# EAGLE schematic single-spi-interface (EAGLE 6.6.0)
DESIGNER: JONNEW, MWL@MIT; DESIGN_NAME: spi-interface (2x64_hirose-circular); LICENSE: (c) Jon Newman CC-BY-SA-NC 4.0; REVISION: 1.2
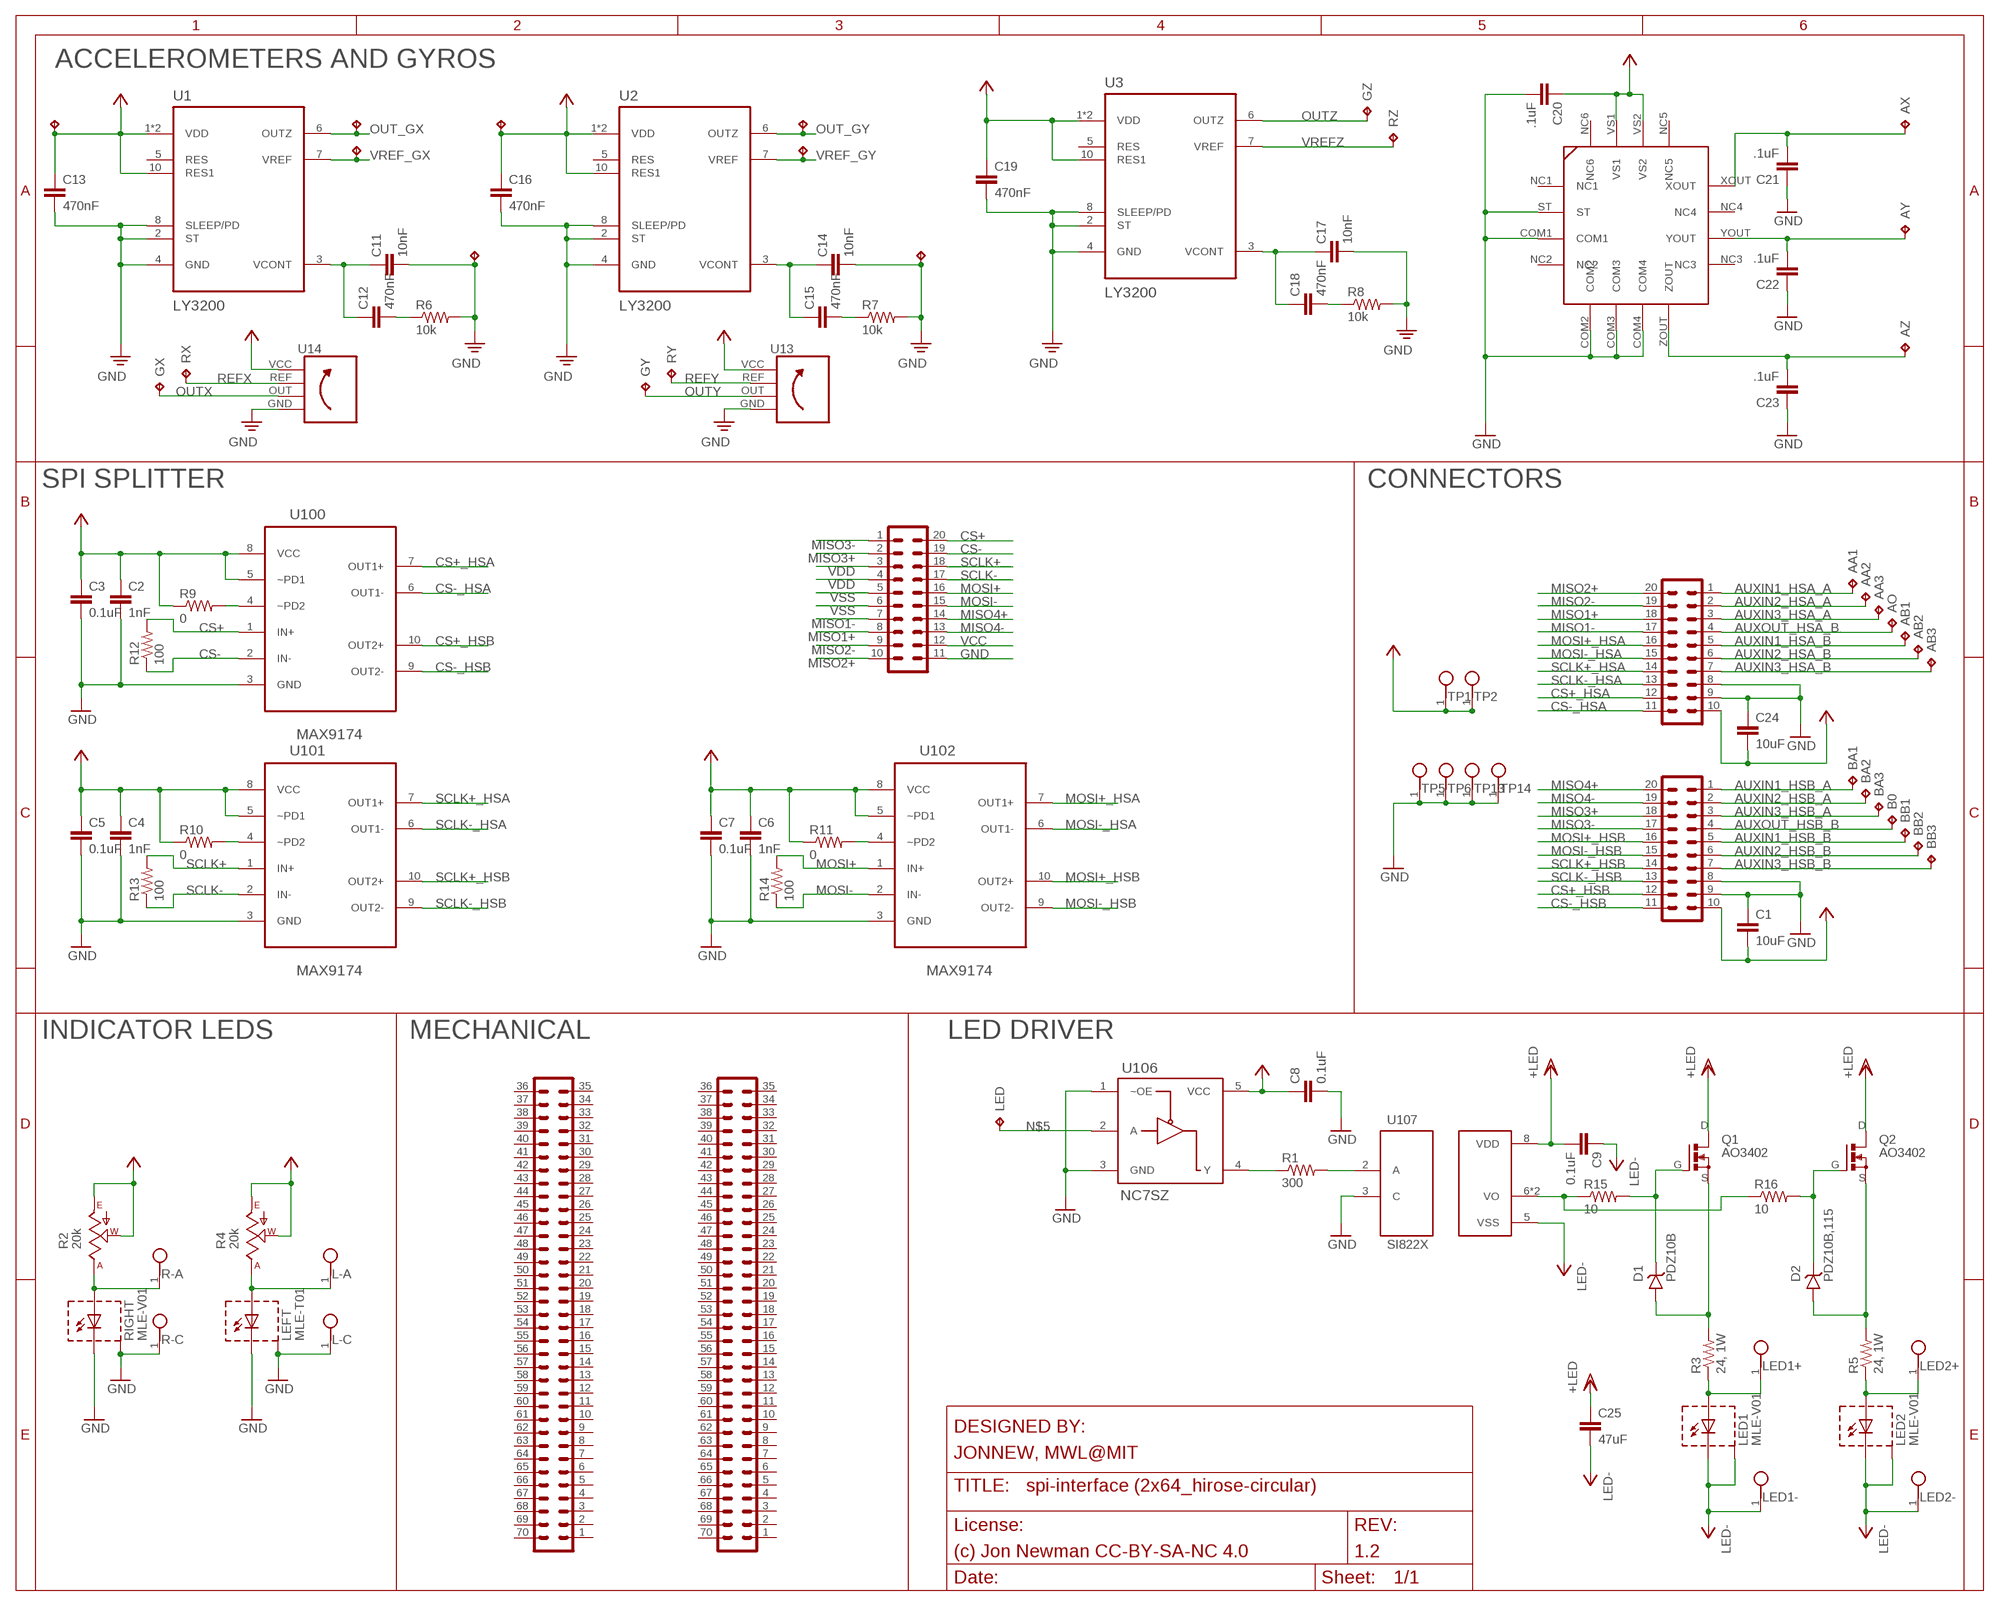
[diagram p0: schematic, sheet 1]

## Parts
AA1  TP_0.5MM  [TESTPOINT_0.5MM]
AA2  TP_0.5MM  [TESTPOINT_0.5MM]
AA3  TP_0.5MM  [TESTPOINT_0.5MM]
AB1  TP_0.5MM  [TESTPOINT_0.5MM]
AB2  TP_0.5MM  [TESTPOINT_0.5MM]
AB3  TP_0.5MM  [TESTPOINT_0.5MM]
AO  TP_0.5MM  [TESTPOINT_0.5MM]
AX  TP_0.5MM  [TESTPOINT_0.5MM]
AY  TP_0.5MM  [TESTPOINT_0.5MM]
AZ  TP_0.5MM  [TESTPOINT_0.5MM]
B0  TP_0.5MM  [TESTPOINT_0.5MM]
BA1  TP_0.5MM  [TESTPOINT_0.5MM]
BA2  TP_0.5MM  [TESTPOINT_0.5MM]
BA3  TP_0.5MM  [TESTPOINT_0.5MM]
BB1  TP_0.5MM  [TESTPOINT_0.5MM]
BB2  TP_0.5MM  [TESTPOINT_0.5MM]
BB3  TP_0.5MM  [TESTPOINT_0.5MM]
C1  10uF  C_0805  [0805]
C2  1nF  C_0201  [0201]
C3  0.1uF  C_0402  [0402]
C4  1nF  C_0201  [0201]
C5  0.1uF  C_0402  [0402]
C6  1nF  C_0201  [0201]
C7  0.1uF  C_0402  [0402]
C8  0.1uF  C_0402  [0402]
C9  0.1uF  C_0402  [0402]
C11  10nF  C_0201  [0201]
C12  470nF  C_0201  [0201]
C13  470nF  C_0201  [0201]
C14  10nF  C_0201  [0201]
C15  470nF  C_0201  [0201]
C16  470nF  C_0201  [0201]
C17  10nF  C_0201  [0201]
C18  470nF  C_0201  [0201]
C19  470nF  C_0201  [0201]
C20  .1uF  C_0402  [0402]
C21  .1uF  C_0201  [0201]
C22  .1uF  C_0201  [0201]
C23  .1uF  C_0201  [0201]
C24  10uF  C_0805  [0805]
C25  47uF  C_1206  [1206]
D1  PDZ10B  Z-DIODE_SOD-323  [SOD-323]
D2  PDZ10B,115  Z-DIODE_SOD-323  [SOD-323]
DIO_E1B  PINHD-2X10_DF40-20REC  [DF40-20REC]
DIO_E1B1  PINHD-2X10_DF40-20REC  [DF40-20REC]
GX  TP_0.5MM  [TESTPOINT_0.5MM]
GY  TP_0.5MM  [TESTPOINT_0.5MM]
GZ  TP_0.5MM  [TESTPOINT_0.5MM]
L-A  TESTPOINT_SMALL  [TESTPOINT_SMALL]
L-C  TESTPOINT_SMALL  [TESTPOINT_SMALL]
LED  TP_0.5MM  [TESTPOINT_0.5MM]
LED1  MLE-V01  LED_PKG-BODY  [LED-MLE]
LED1+  TESTPOINT_SMALL  [TESTPOINT_SMALL]
LED1-  TESTPOINT_SMALL  [TESTPOINT_SMALL]
LED2  MLE-V01  LED_PKG-BODY  [LED-MLE]
LED2+  TESTPOINT_SMALL  [TESTPOINT_SMALL]
LED2-  TESTPOINT_SMALL  [TESTPOINT_SMALL]
LEFT  MLE-T01  LED_PKG-BODY  [LED-MLE]
MECH_E0B  PINHD-2X35_DF40REC  [DF40-70REC]
MECH_W0B  PINHD-2X35_DF40REC  [DF40-70REC]
Q1  AO3402  N-MOSFET_SOT23-GSD  [SOT23-GSD]
Q2  AO3402  N-MOSFET_SOT23-GSD  [SOT23-GSD]
R1  300  R_0402  [0402]
R2  20k  TRIM_US-SM-42/43W  [SM-42/43W]
R3  24, 1W  R_0805  [0805]
R4  20k  TRIM_US-SM-42/43W  [SM-42/43W]
R5  24, 1W  R_0805  [0805]
R6  10k  R_0201  [0201]
R7  10k  R_0201  [0201]
R8  10k  R_0201  [0201]
R9  0  R_0201  [0201]
R10  0  R_0201  [0201]
R11  0  R_0201  [0201]
R12  100  R_0201  [0201]
R13  100  R_0201  [0201]
R14  100  R_0201  [0201]
R15  10  R_0402  [0402]
R16  10  R_0402  [0402]
R-A  TESTPOINT_SMALL  [TESTPOINT_SMALL]
R-C  TESTPOINT_SMALL  [TESTPOINT_SMALL]
RIGHT  MLE-V01  LED_PKG-BODY  [LED-MLE]
RX  TP_0.5MM  [TESTPOINT_0.5MM]
RY  TP_0.5MM  [TESTPOINT_0.5MM]
RZ  TP_0.5MM  [TESTPOINT_0.5MM]
TETHER  PINHD-2X10_T1M  [T1M-10-T-DV]
TP1  TESTPOINT_SMALL  [TESTPOINT_SMALL]
TP2  TESTPOINT_SMALL  [TESTPOINT_SMALL]
TP3  TPTP08SQ  [TP08SQ]
TP4  TPTP08SQ  [TP08SQ]
TP5  TESTPOINT_SMALL  [TESTPOINT_SMALL]
TP6  TESTPOINT_SMALL  [TESTPOINT_SMALL]
TP7  TPTP08SQ  [TP08SQ]
TP8  TPTP08SQ  [TP08SQ]
TP9  TPTP08SQ  [TP08SQ]
TP10  TPTP08SQ  [TP08SQ]
TP11  TPTP08SQ  [TP08SQ]
TP12  TPTP08SQ  [TP08SQ]
TP13  TESTPOINT_SMALL  [TESTPOINT_SMALL]
TP14  TESTPOINT_SMALL  [TESTPOINT_SMALL]
U1  LY3200  LY3200ALH_LGA-10-COMPACT  [LGA-10-COMPACT]
U2  LY3200  LY3200ALH_LGA-10-COMPACT  [LGA-10-COMPACT]
U3  LY3200  LY3200ALH_LGA-10-COMPACT  [LGA-10-COMPACT]
U4  ADXL335  [ADXL335]
U13  LY3200-VERT-MODULE  [LY3200-VERT-MODULE]
U14  LY3200-VERT-MODULE  [LY3200-VERT-MODULE]
U100  MAX9174  MAX9174_UMAX  [10-UMAX]
U101  MAX9174  MAX9174_UMAX  [10-UMAX]
U102  MAX9174  MAX9174_UMAX  [10-UMAX]
U106  NC7SZ  NC7SZ125  [SOT-23-5]
U107  SI822X  [SOIC127P500X400-8N]

## Nets
AUXIN1_HSA_A: AA1.1(TP) DIO_E1B.1
AUXIN1_HSA_B: AB1.1(TP) DIO_E1B.5
AUXIN1_HSB_A: BA1.1(TP) DIO_E1B1.1
AUXIN1_HSB_B: BB1.1(TP) DIO_E1B1.5
AUXIN2_HSA_A: AA2.1(TP) DIO_E1B.2
AUXIN2_HSA_B: AB2.1(TP) DIO_E1B.6
AUXIN2_HSB_A: BA2.1(TP) DIO_E1B1.2
AUXIN2_HSB_B: BB2.1(TP) DIO_E1B1.6
AUXIN3_HSA_A: AA3.1(TP) DIO_E1B.3
AUXIN3_HSA_B: AB3.1(TP) DIO_E1B.7
AUXIN3_HSB_A: BA3.1(TP) DIO_E1B1.3
AUXIN3_HSB_B: BB3.1(TP) DIO_E1B1.7
AUXOUT_HSA_B: AO.1(TP) DIO_E1B.4
AUXOUT_HSB_B: B0.1(TP) DIO_E1B1.4
CS+: R12.2 TETHER.20 U100.1(IN+)
CS+_HSA: DIO_E1B.12 U100.7(OUT1+)
CS+_HSB: DIO_E1B1.12 U100.10(OUT2+)
CS-: R12.1 TETHER.19 U100.2(IN-)
CS-_HSA: DIO_E1B.11 U100.6(OUT1-)
CS-_HSB: DIO_E1B1.11 U100.9(OUT2-)
GND: C1.1 C2.2 C3.2 C4.2 C5.2 C6.2 C7.2 C8.2 C11.2 C13.2 C14.2 C16.2 C17.2 C19.2 C20.2 C21.1 C22.1 C23.1 C24.1 DIO_E1B1.8 DIO_E1B1.9 DIO_E1B.8 DIO_E1B.9 L-C.1 LEFT.C1(C) LEFT.C2(C) LEFT.HS(BODY) R6.2 R7.2 R8.2 R-C.1 RIGHT.C1(C) RIGHT.C2(C) RIGHT.HS(BODY) TETHER.11 TP5.1 TP6.1 TP7.TP TP11.TP TP13.1 TP14.1 U1.2(ST) U1.4(GND) U1.8(SLEEP/PD) U2.2(ST) U2.4(GND) U2.8(SLEEP/PD) U3.2(ST) U3.4(GND) U3.8(SLEEP/PD) U4.COM1 U4.COM2 U4.COM3 U4.COM4 U4.ST U13.GND U14.GND U100.3(GND) U101.3(GND) U102.3(GND) U106.1(~OE) U106.3(GND) U107.3(C)
MISO1+: DIO_E1B.18 TETHER.8
MISO1-: DIO_E1B.17 TETHER.7
MISO2+: DIO_E1B.20 TETHER.10
MISO2-: DIO_E1B.19 TETHER.9
MISO3+: DIO_E1B1.18 TETHER.2
MISO3-: DIO_E1B1.17 TETHER.1
MISO4+: DIO_E1B1.20 TETHER.14
MISO4-: DIO_E1B1.19 TETHER.13
MOSI+: R14.2 TETHER.16 U102.1(IN+)
MOSI+_HSA: DIO_E1B.16 U102.7(OUT1+)
MOSI+_HSB: DIO_E1B1.16 U102.10(OUT2+)
MOSI-: R14.1 TETHER.15 U102.2(IN-)
MOSI-_HSA: DIO_E1B.15 U102.6(OUT1-)
MOSI-_HSB: DIO_E1B1.15 U102.9(OUT2-)
N$1: R1.2 U107.2(A)
N$2: C11.1 C12.1 U1.3(VCONT)
N$3: LED1+.1 LED1.A1(A) LED1.A2(A) R3.1
N$4: D1.A Q1.S R3.2
N$5: LED.1(TP) U106.2(A)
N$6: R1.1 U106.4(Y)
N$7: D2.C Q2.G R16.2
N$8: C12.2 R6.1
N$9: R2.1(A) R-A.1 RIGHT.A1(A) RIGHT.A2(A)
N$10: C14.1 C15.1 U2.3(VCONT)
N$11: D2.A Q2.S R5.2
N$12: LED2+.1 LED2.A1(A) LED2.A2(A) R5.1
N$13: L-A.1 LEFT.A1(A) LEFT.A2(A) R4.1(A)
N$14: C15.2 R7.1
N$15: C17.1 C18.1 U3.3(VCONT)
N$16: C18.2 R8.1
N$17: R9.2 U100.4(~PD2)
N$18: R11.2 U102.4(~PD2)
N$19: R10.2 U101.4(~PD2)
N$20: D1.C Q1.G R15.2
N$22: R15.1 R16.1 U107.6(VO) U107.7(VO)
OUT_GX: TP4.TP U1.6(OUTZ)
OUT_GY: TP10.TP U2.6(OUTZ)
OUTX: GX.1(TP) U14.OUT
OUTY: GY.1(TP) U13.OUT
OUTZ: GZ.1(TP) U3.6(OUTZ)
REFX: RX.1(TP) U14.REF
REFY: RY.1(TP) U13.REF
SCLK+: R13.2 TETHER.18 U101.1(IN+)
SCLK+_HSA: DIO_E1B.14 U101.7(OUT1+)
SCLK+_HSB: DIO_E1B1.14 U101.10(OUT2+)
SCLK-: R13.1 TETHER.17 U101.2(IN-)
SCLK-_HSA: DIO_E1B.13 U101.6(OUT1-)
SCLK-_HSB: DIO_E1B1.13 U101.9(OUT2-)
VCC: C1.2 C2.1 C3.1 C4.1 C5.1 C6.1 C7.1 C8.1 C13.1 C16.1 C19.1 C20.1 C24.2 DIO_E1B1.10 DIO_E1B.10 R2.2(W) R2.3(E) R4.2(W) R4.3(E) R9.1 R10.1 R11.1 TETHER.12 TP1.1 TP2.1 TP3.TP TP9.TP U1.1(VDD) U1.9(VDD) U1.10(RES1) U2.1(VDD) U2.9(VDD) U2.10(RES1) U3.1(VDD) U3.9(VDD) U3.10(RES1) U4.VS1 U4.VS2 U13.VCC U14.VCC U100.5(~PD1) U100.8(VCC) U101.5(~PD1) U101.8(VCC) U102.5(~PD1) U102.8(VCC) U106.5(VCC)
VDD: C9.2 C25.1 Q1.D Q2.D TETHER.3 TETHER.4 U107.8(VDD) ; supply symbol labelled +LED
VREF_GX: TP8.TP U1.7(VREF)
VREF_GY: TP12.TP U2.7(VREF)
VREFZ: RZ.1(TP) U3.7(VREF)
VSS: C9.1 C25.2 LED1-.1 LED1.C1(C) LED1.C2(C) LED1.HS(BODY) LED2-.1 LED2.C1(C) LED2.C2(C) LED2.HS(BODY) TETHER.5 TETHER.6 U107.5(VSS) ; supply symbol labelled LED-
XOUT1: AX.1(TP) C21.2 U4.XOUT
YOUT1: AY.1(TP) C22.2 U4.YOUT
ZOUT1: AZ.1(TP) C23.2 U4.ZOUT
Unconnected: MECH_E0B.1 MECH_E0B.2 MECH_E0B.3 MECH_E0B.4 MECH_E0B.5 MECH_E0B.6 MECH_E0B.7 MECH_E0B.8 MECH_E0B.9 MECH_E0B.10 MECH_E0B.11 MECH_E0B.12 MECH_E0B.13 MECH_E0B.14 MECH_E0B.15 MECH_E0B.16 MECH_E0B.17 MECH_E0B.18 MECH_E0B.19 MECH_E0B.20 MECH_E0B.21 MECH_E0B.22 MECH_E0B.23 MECH_E0B.24 MECH_E0B.25 MECH_E0B.26 MECH_E0B.27 MECH_E0B.28 MECH_E0B.29 MECH_E0B.30 MECH_E0B.31 MECH_E0B.32 MECH_E0B.33 MECH_E0B.34 MECH_E0B.35 MECH_E0B.36 MECH_E0B.37 MECH_E0B.38 MECH_E0B.39 MECH_E0B.40 MECH_E0B.41 MECH_E0B.42 MECH_E0B.43 MECH_E0B.44 MECH_E0B.45 MECH_E0B.46 MECH_E0B.47 MECH_E0B.48 MECH_E0B.49 MECH_E0B.50 MECH_E0B.51 MECH_E0B.52 MECH_E0B.53 MECH_E0B.54 MECH_E0B.55 MECH_E0B.56 MECH_E0B.57 MECH_E0B.58 MECH_E0B.59 MECH_E0B.60 MECH_E0B.61 MECH_E0B.62 MECH_E0B.63 MECH_E0B.64 MECH_E0B.65 MECH_E0B.66 MECH_E0B.67 MECH_E0B.68 MECH_E0B.69 MECH_E0B.70 MECH_W0B.1 MECH_W0B.2 MECH_W0B.3 MECH_W0B.4 MECH_W0B.5 MECH_W0B.6 MECH_W0B.7 MECH_W0B.8 MECH_W0B.9 MECH_W0B.10 MECH_W0B.11 MECH_W0B.12 MECH_W0B.13 MECH_W0B.14 MECH_W0B.15 MECH_W0B.16 MECH_W0B.17 MECH_W0B.18 MECH_W0B.19 MECH_W0B.20 MECH_W0B.21 MECH_W0B.22 MECH_W0B.23 MECH_W0B.24 MECH_W0B.25 MECH_W0B.26 MECH_W0B.27 MECH_W0B.28 MECH_W0B.29 MECH_W0B.30 MECH_W0B.31 MECH_W0B.32 MECH_W0B.33 MECH_W0B.34 MECH_W0B.35 MECH_W0B.36 MECH_W0B.37 MECH_W0B.38 MECH_W0B.39 MECH_W0B.40 MECH_W0B.41 MECH_W0B.42 MECH_W0B.43 MECH_W0B.44 MECH_W0B.45 MECH_W0B.46 MECH_W0B.47 MECH_W0B.48 MECH_W0B.49 MECH_W0B.50 MECH_W0B.51 MECH_W0B.52 MECH_W0B.53 MECH_W0B.54 MECH_W0B.55 MECH_W0B.56 MECH_W0B.57 MECH_W0B.58 MECH_W0B.59 MECH_W0B.60 MECH_W0B.61 MECH_W0B.62 MECH_W0B.63 MECH_W0B.64 MECH_W0B.65 MECH_W0B.66 MECH_W0B.67 MECH_W0B.68 MECH_W0B.69 MECH_W0B.70 U1.5(RES) U2.5(RES) U3.5(RES) U4.NC1 U4.NC2 U4.NC3 U4.NC4 U4.NC5 U4.NC6

## Notes on the sheet
- ACCELEROMETERS AND GYROS
- SPI SPLITTER | CONNECTORS
- INDICATOR LEDS | MECHANICAL | LED DRIVER

## Library data of the parts
AA1-AA3 AB1-AB3 AO AX AY AZ B0 BA1-BA3 BB1-BB3 GX GY GZ LED RX RY RZ TP3 TP4 TP7-TP12 = jonnew:TP: Test pad
C1 C24 = headstage:C: Capacitor; MN: TDK Corp.; PARTNO: C2012X5R1Cxxxxxxx; VID: DK
C2-C9 C11-C19 C21-C23 C25 = jonnew:C: Capacitor
C20 = headstage:C: Capacitor
D1 D2 = jonnew:Z-DIODE: Zener Diode
DIO_E1B DIO_E1B1 TETHER = jonnew:PINHD-2X10
L-A L-C LED1+ LED1- LED2+ LED2- R-A R-C TP1 TP2 TP5 TP6 TP13 TP14 = jonnew:TESTPOINT: PCB Test Point
LED1 LED2 LEFT RIGHT = jonnew:LED_PKG-BODY
MECH_E0B MECH_W0B = jonnew:PINHD-2X35
Q1 Q2 = jonnew:N-MOSFET: N-CHANNEL MOS FET SYMBOL
R1 R3 R5-R16 = jonnew:R: Resistor
R2 R4 = jonnew:TRIM_US-: POTENTIOMETER
U1-U3 = jonnew:LY3200ALH
U4 = jonnew:ADXL335: The ADXL335 is a small, thin, low power, complete 3-axis accelerometer with signal conditioned voltage outputs. The product measures acceleration with a minimum full-scale range of ±3 g. It can measure the static acceleration of gravity in tilt-sensing applications, as well as dynamic acceleration resulting from motion, shock, or vibration. The user selects the bandwidth of the accelerometer using the CX, CY, and CZ capacitors at the XOUT, YOUT, and ZOUT pins. Bandwidths can be selected to suit the application, with a range of 0.5 Hz to 1600 Hz for the X and Y axes, and a range of 0.5 Hz to 550 Hz for the Z axi
U13 U14 = jonnew:LY3200-VERT-MODULE
U100-U102 = jonnew:MAX9174
U106 = jonnew:NC7SZ125
U107 = jonnew:SI822X

## Net classes
1 thick: width 0.102 mm